# EAGLE design Adafruit CC3000 Breakout (EAGLE 7.2.0)
COMPANY: ADAFRUIT INDUSTRIES; DRAWN: KTOWN; REV: C
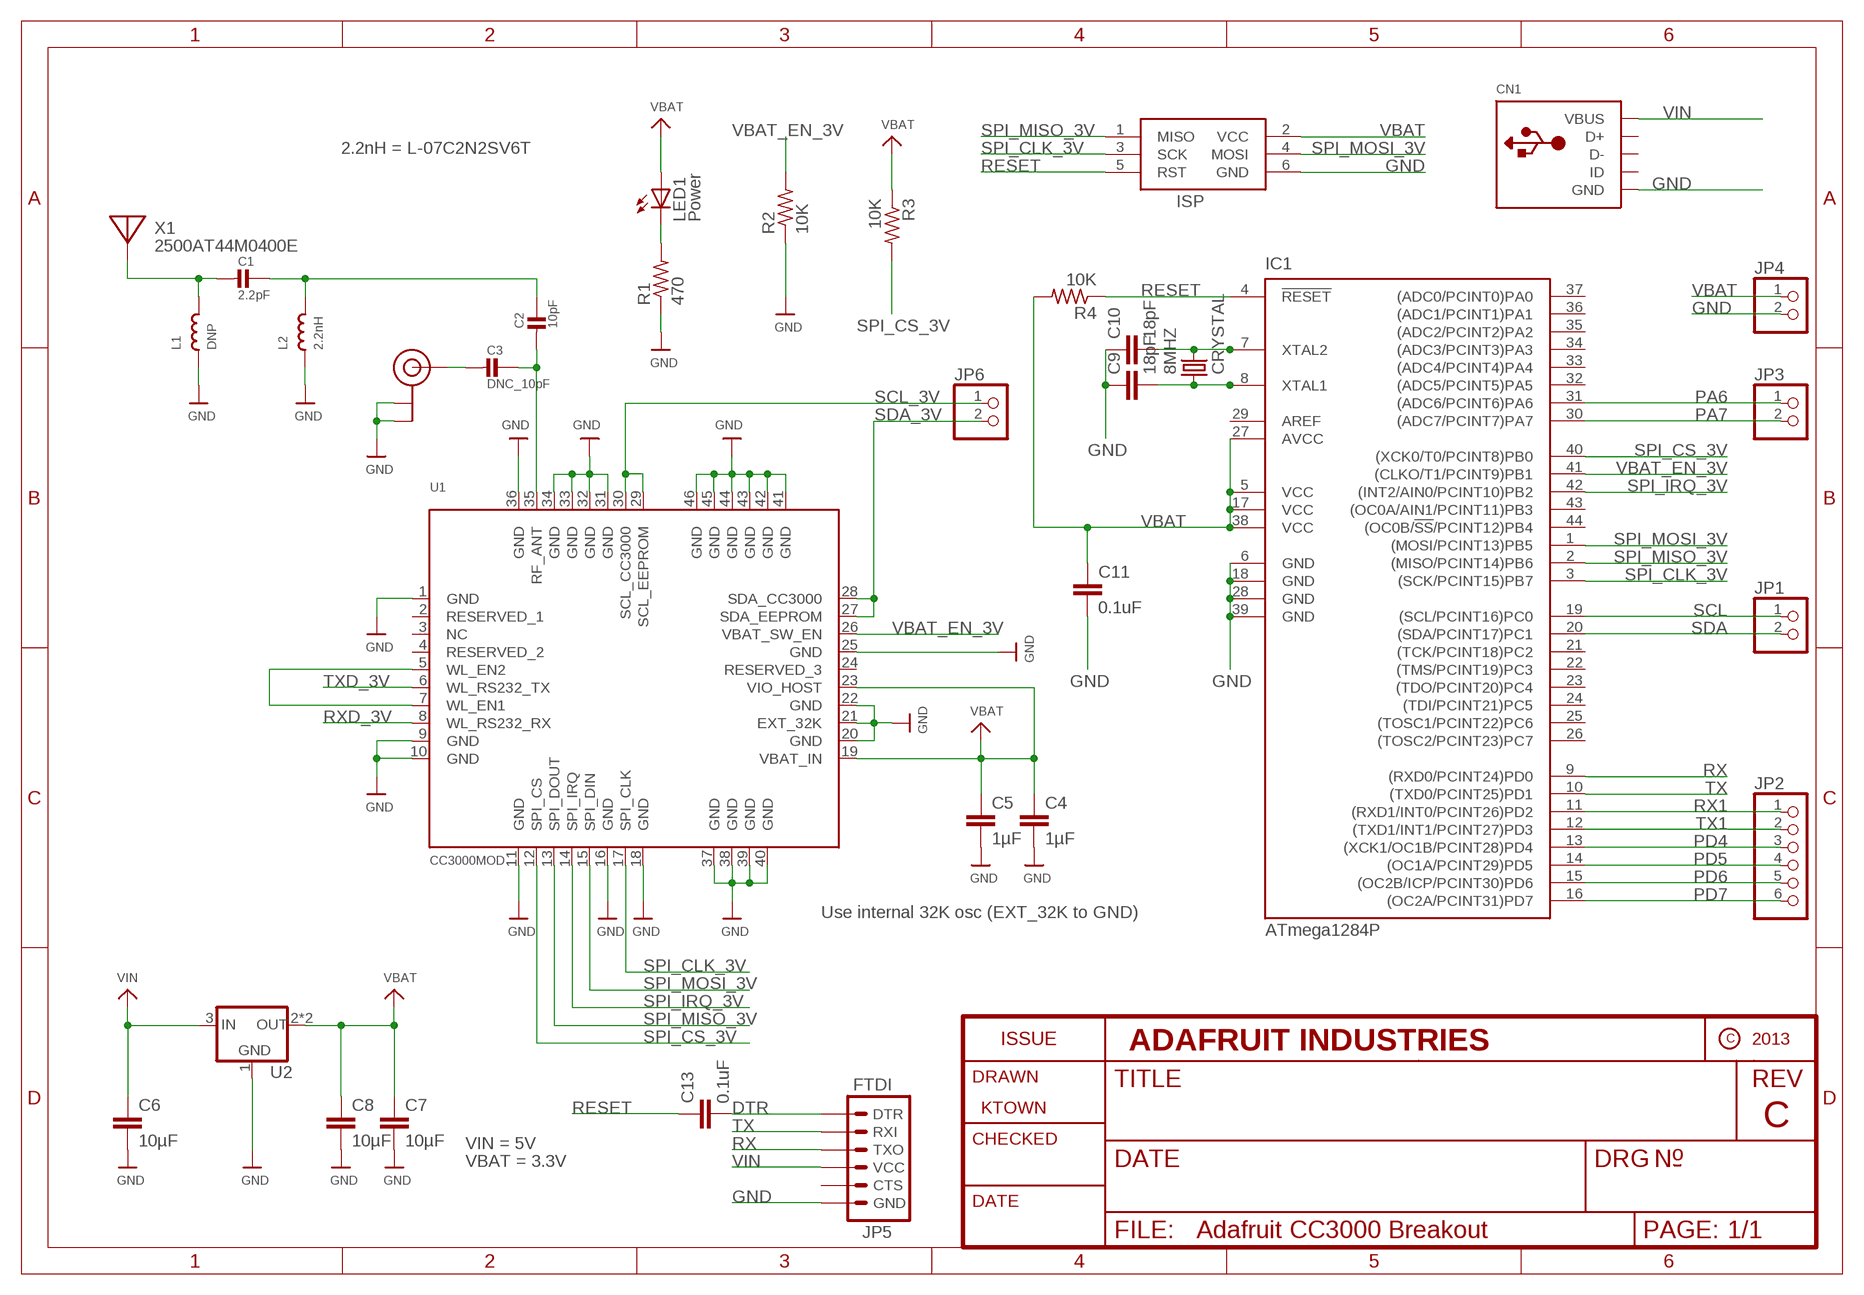
[diagram p0: schematic, sheet 1]

## Parts
8MHZ  CRYSTAL  [2-SMD-5X3MM]
C1  2.2pF  CAP_CERAMIC_0402  [_0402]
C2  10pF  CAP_CERAMIC_0402  [_0402]
C3  DNC_10pF  CAP_CERAMIC_0402  [_0402]
C4  1µF  C-EUC1206  [C1206]
C5  1µF  C-EUC1206  [C1206]
C6  10µF  C-EUC1206  [C1206]
C7  10µF  C-EUC1206  [C1206]
C8  10µF  C-EUC1206  [C1206]
C9  18pF  C-EUC1206  [C1206]
C10  18pF  C-EUC1206  [C1206]
C11  0.1uF  C-EUC1206  [C1206]
C13  0.1uF  C-EUC1206  [C1206]
CN1  USBPWR  [USB-MINIB-POWER]
IC1  ATmega1284P  MEGA164P/324P/644P-AU  [TQFP44]
ISP  AVRISP-6  [AVRISP]
JP1  PINHD-1X2  [1X02]
JP2  PINHD-1X6  [1X06]
JP3  PINHD-1X2  [1X02]
JP4  PINHD-1X2  [1X02]
JP5  FTDI  ARDUINO_SERIAL_PROGRAMPTH  [1X06]
JP6  PINHD-1X2  [1X02]
L1  DNP  INDUCTOR_0402  [_0402]
L2  2.2nH  INDUCTOR_0402  [_0402]
LED1  Power  LEDSMT1206  [1206]
R1  470  R-US_R1206  [R1206]
R2  10K  R-US_R1206  [R1206]
R3  10K  R-US_R1206  [R1206]
R4  10K  R-US_R1206  [R1206]
U1  CC3000MOD  [CC3000MOD]
U2  VREG_SOT223  [SOT223-R]
U$35  U.FL  [U.FL]
X1  2500AT44M0400E  ANTENNA_JOHANSON_2500AT44M0400  [ANT_2500AT44M0400]

## Nets
DTR: C13.2 JP5.DTR
GND: C4.2 C5.2 C6.2 C7.2 C8.2 C9.1 C10.1 C11.2 CN1.GND IC1.6(GND) IC1.18(GND) IC1.28(GND) IC1.39(GND) ISP.6(GND) JP4.2 JP5.GND L1.1 L2.1 R1.1 R2.1 U1.1(GND) U1.9(GND) U1.10(GND) U1.11(GND) U1.16(GND) U1.18(GND) U1.20(GND) U1.21(EXT_32K) U1.22(GND) U1.25(GND) U1.31(GND) U1.32(GND) U1.33(GND) U1.34(GND) U1.36(GND) U1.37(GND) U1.38(GND) U1.39(GND) U1.40(GND) U1.41(GND) U1.42(GND) U1.43(GND) U1.44(GND) U1.45(GND) U1.46(GND) U2.1(GND) U$35.P$1(GND) U$35.P$2(GND)
N$1: C1.2 L1.2 X1.FEED
N$2: C1.1 C2.1 L2.2
N$3: C3.2 U$35.P$3(SIGNAL)
N$4: C2.2 C3.1 U1.35(RF_ANT)
N$6: U1.5(WL_EN2) U1.7(WL_EN1)
N$7: LED1.C R1.2
N$8: 8MHZ.P$2 C10.2 IC1.7(XTAL2)
N$10: 8MHZ.P$1 C9.2 IC1.8(XTAL1)
PA6: IC1.31((ADC6/PCINT6)PA6) JP3.1
PA7: IC1.30((ADC7/PCINT7)PA7) JP3.2
PD4: IC1.13((XCK1/OC1B/PCINT28)PD4) JP2.3
PD5: IC1.14((OC1A/PCINT29)PD5) JP2.4
PD6: IC1.15((OC2B/ICP/PCINT30)PD6) JP2.5
PD7: IC1.16((OC2A/PCINT31)PD7) JP2.6
RESET: C13.1 IC1.4(!RESET) ISP.5(RST) R4.1
RX: IC1.9((RXD0/PCINT24)PD0) JP5.TXO
RX1: IC1.11((RXD1/INT0/PCINT26)PD2) JP2.1
RXD_3V: U1.8(WL_RS232_RX)
SCL: IC1.19((SCL/PCINT16)PC0) JP1.1
SCL_3V: JP6.1 U1.29(SCL_EEPROM) U1.30(SCL_CC3000)
SDA: IC1.20((SDA/PCINT17)PC1) JP1.2
SDA_3V: JP6.2 U1.27(SDA_EEPROM) U1.28(SDA_CC3000)
SPI_CLK_3V: IC1.3((SCK/PCINT15)PB7) ISP.3(SCK) U1.17(SPI_CLK)
SPI_CS_3V: IC1.40((XCK0/T0/PCINT8)PB0) R3.2 U1.12(SPI_CS)
SPI_IRQ_3V: IC1.42((INT2/AIN0/PCINT10)PB2) U1.14(SPI_IRQ)
SPI_MISO_3V: IC1.2((MISO/PCINT14)PB6) ISP.1(MISO) U1.13(SPI_DOUT)
SPI_MOSI_3V: IC1.1((MOSI/PCINT13)PB5) ISP.4(MOSI) U1.15(SPI_DIN)
TX: IC1.10((TXD0/PCINT25)PD1) JP5.RXI
TX1: IC1.12((TXD1/INT1/PCINT27)PD3) JP2.2
TXD_3V: U1.6(WL_RS232_TX)
VBAT [power]: C4.1 C5.1 C7.1 C8.1 C11.1 IC1.5(VCC) IC1.17(VCC) IC1.27(AVCC) IC1.38(VCC) ISP.2(VCC) JP4.1 LED1.A R3.1 R4.2 U1.19(VBAT_IN) U1.23(VIO_HOST) U2.2(OUT) U2.4(OUT)
VBAT_EN_3V: IC1.41((CLKO/T1/PCINT9)PB1) R2.2 U1.26(VBAT_SW_EN)
VIN [power]: C6.1 CN1.VBUS JP5.VCC U2.3(IN)
Unconnected: CN1.D+ CN1.D- CN1.ID IC1.21((TCK/PCINT18)PC2) IC1.22((TMS/PCINT19)PC3) IC1.23((TDO/PCINT20)PC4) IC1.24((TDI/PCINT21)PC5) IC1.25((TOSC1/PCINT22)PC6) IC1.26((TOSC2/PCINT23)PC7) IC1.32((ADC5/PCINT5)PA5) IC1.33((ADC4/PCINT4)PA4) IC1.34((ADC3/PCINT3)PA3) IC1.35((ADC2/PCINT2)PA2) IC1.36((ADC1/PCINT1)PA1) IC1.37((ADC0/PCINT0)PA0) IC1.43((OC0A/AIN1/PCINT11)PB3) IC1.44((OC0B/!SS!/PCINT12)PB4) JP5.CTS U1.2(RESERVED_1) U1.3(NC) U1.4(RESERVED_2) U1.24(RESERVED_3)

## Notes on the sheet
- 2.2nH = L-07C2N2SV6T
- Use internal 32K osc (EXT_32K to GND)
- VIN = 5V
- VBAT = 3.3V

## Power pins joined to a net without a drawn wire
AREF: IC1.29(AREF)

## Library data of the parts
8MHZ = Net Widget:CRYSTAL
C1-C3 = microbuilder:CAP_CERAMIC: Ceramic Capacitors For new designs, use the packages preceded by an '_' character since they are more reliable: The following footprints should be used on most boards: _0402 - Standard footprint for regular board layouts _0603 - Standard footprint for regular board layouts _0805 - Standard footprint for regular board layouts For extremely tight-pitch boards where space is at a premium, the following 'micro-pitch' footprints can be used (smaller pads, no silkscreen outline, etc.): _0402MP - Micro-pitch footprint for very dense/compact boards _0603MP - Micro-pitch footprint for very dense/compact boards _0805MP - Micro-pitch footprint for very dense/compact boards Commonly Stocked Parts 0402 - 0402 Surface Mount Capacitors 16pF 50V 5% [Digikey: 445-4899-2-ND] 18pF 50V 5% [Digikey: 490-1281-2-ND] 22pF 50V 5% [Digikey: 490-1283-2-ND] 68pF 50V 5% [Digikey: 490-1289-2-ND] 0.1uF 10V 10% [Digikey: 490-1318-2-ND] 1.0uF 6.3V 10% [Digikey: 490-1320-2-ND] 0603 - 0603 Surface Mount Capacitors 16 pF 50V 5% [Digikey: 445-5051-2-ND] 22 pF 50V [Digikey: PCC220ACVTR-ND] 33 pF 50V 5% [Digikey: 490-1415-1-ND] 56pF 50V 5% [Digikey: 490-1421-1-ND] 220pF 50V 5% [Digikey: 445-1285-1-ND] 680 pF 50V 2200 pF 50V 5% C0G [Digikey: 445-1297-1-ND] 5600 pF 100V 5% X7R [Digikey: 478-3711-1-ND] 0.1 µF 25V 10% [Digikey: PCC2277TR-ND] 0.22 µF 16V 10% X7R [Digikey: 445-1318-1-ND] 1.0 µF 25V 10% [Digikey: 445-5146-2-ND] 0603 - RF Specific 3pF 250V +/-0.1pF RF [Digikey: 712-1347-1-ND] 18 pF 250V 5% [Digikey: 478-3505-1-ND or 712-1322-1-ND] 56 pF 250V 5% C0G RF [Digikey: 490-4867-1-ND] 68 pF 250V RF [Digikey: 490-4868-1-ND] 0805 - 0805 Surface Mount Capacitors 220 pF 250V 2% RF Ceramic Capacitor [Digikey: 712-1398-1-ND] 1000 pF 50V 2% NP0 Ceramic Capacitor [Digikey: 478-3760-1-ND] 0.1 µF 25V 10% Ceramic Capacitor [Digikey: PCC1828TR-ND] 1.0 µF 16V 10% Ceramic Capacitor[Digikey: 490-1691-2-ND] 10.0 µF 10V 10% Ceramic Capacitor[Digikey: 709-1228-1-ND] 10.0 uF 16V 10% Ceramic Capacitor [Digikey: 478-5165-2-ND] 47 uF 6.3V 20% Ceramic Capacitor [Digikey: 587-1779-1-ND or 399-5506-1-ND] 1206 - 1206 Surface Mount Capacitors 47uF 10V 20% Ceramic Capacitor [Digikey: 490-5528-1-ND or 399-5508-1-ND or 445-6010-1-ND] 100uF 6.3V -20%, +80% Y5V Ceramic Capacitor (Digikey: 490-4512-1-ND, Mouser: 81-GRM31CF50J107ZE1L)
C4-C11 C13 = rcl:C-EU: CAPACITOR, European symbol
CN1 = Net Widget:USB: USB Connectors USBMINIB - Surface Mount Female Mini-B USB Connector 4UConnector: 06564 By microbuilder.eu Thru-hole RA Female Mini-B USB Connector 4UConnector: 18732 By ladyada.net
IC1 = avr-5:MEGA164P/324P/644P-AU
ISP = adafruit:AVRISP: AVR ISP HEADER Standard 6 pin header for AVR programming
JP1 JP3 JP4 JP6 = pinhead:PINHD-1X2: PIN HEADER
JP2 = pinhead:PINHD-1X6: PIN HEADER
JP5 = Net Widget:ARDUINO_SERIAL_PROGRAM: FTDI connector footprints
L1 L2 = microbuilder:INDUCTOR: Inductors 0603: 10nH Ceramic Inductor - microwire antenna/RF (Digikey: 712-1434-2-ND) 0805: 560nH Ceramic Inductor - RF (Digikey: 553-1047-1-ND) 270nH Ceramic Inductor - Q = 40@250MHz, +-5%, 1 Ohm DC Resistance (Digikey: 535-10506-2-ND) 1007 (2518 Metric) SMT: 10µH 10% 250mOhm 820mA 1007 Inductor (Digikey: 587-2189-1-ND) 22µH 10% 500mOhm 580mA 1007 Inductor (Digikey: 587-2190-1-ND) 47µH 10% 950mOhm 420mA 1007 Inductor (Digikey: 587-2191-1-ND) 47µH 5% 100mOhm 1A 1008 Inductor (Digikey: 732-1816-1-ND) 5.0x5.0mm (Taiyo Yuden NR5040 Series) 6.8µH 20% 2.3A 64mOhm Inductor (Digikey: 587-2374-2-ND) 5.0x5.0mm (TDK VLC5045 Series) 4.7µH 20% 3.3A 34mOhm Inductor (Digikey: 445-6526-1-ND) 6.8µH 20% 2.7A 46mOhm Inductor (Digikey: 445-6527-1-ND) 6.0x6.0mm (TDK VLC6045 Series) 4.7µH 20% 3.8A 27mOhm Inductor (Digikey: 445-6538-2-ND) 6.8µH 20% 3A 41mOhm Inductor (Digikey: 445-6540-1-ND) 6.2µH 30% 2.2A 45mOhm Inductor (Digikey: SRR5028-6R2YCT-ND) - Not TDK VLC6045 but footprint should match 6.0x6.0mm (TDK SLF6045 Series) 6.8uH 30% 2A 33mOhm Inductor (Digikey: 445-4572-1-ND, Mouser: 810-SLF645T6R8N2R0PF) 6.0x6.0mm (Sumida CDRH5D28 Series) 6.2uH 30% 1.8A 45mOhm Inductor (Digikey: 308-1542-1-ND) Taiyo Yuden NR3015T2R2M - 2.2uH 20% 1.5A (Digikey: 587-1648-2-ND, Mouser: 963-NR3015T2R2M) - Used with TI TPS62172 CoilCraft RFID Transponder Coil - MA5532-AE (For use with AS3935 Lightning Sensor)
LED1 = led:LED: LED OSRAM: - CHIPLED LG R971, LG N971, LY N971, LG Q971, LY Q971, LO R971, LY R971 LH N974, LH R974 LS Q976, LO Q976, LY Q976 LO Q996 - Hyper CHIPLED LW Q18S LB Q993, LB Q99A, LB R99A - SideLED LS A670, LO A670, LY A670, LG A670, LP A670 LB A673, LV A673, LT A673, LW A673 LH A674 LY A675 LS A676, LA A676, LO A676, LY A676, LW A676 LS A679, LY A679, LG A679 - Hyper Micro SIDELED® LS Y876, LA Y876, LO Y876, LY Y876 LT Y87S - SmartLED LW L88C, LW L88S LB L89C, LB L89S, LG L890 LS L89K, LO L89K, LY L89K LS L896, LA L896, LO L896, LY L896 - TOPLED LS T670, LO T670, LY T670, LG T670, LP T670 LSG T670, LSP T670, LSY T670, LOP T670, LYG T670 LG T671, LOG T671, LSG T671 LB T673, LV T673, LT T673, LW T673 LH T674 LS T676, LA T676, LO T676, LY T676, LB T676, LH T676, LSB T676, LW T676 LB T67C, LV T67C, LT T67C, LS T67K, LO T67K, LY T67K, LW E67C LS E67B, LA E67B, LO E67B, LY E67B, LB E67C, LV E67C, LT E67C LW T67C LS T679, LY T679, LG T679 LS T770, LO T770, LY T770, LG T770, LP T770 LB T773, LV T773, LT T773, LW T773 LH T774 LS E675, LA E675, LY E675, LS T675 LS T776, LA T776, LO T776, LY T776, LB T776 LHGB T686 LT T68C, LB T68C - Hyper Mini TOPLED® LB M676 - Mini TOPLED Santana® LG M470 LS M47K, LO M47K, LY M47K Source: http://www.osram.convergy.de LUXEON: - LUMILED® LXK2-PW12-R00, LXK2-PW12-S00, LXK2-PW14-U00, LXK2-PW14-V00 LXK2-PM12-R00, LXK2-PM12-S00, LXK2-PM14-U00 LXK2-PE12-Q00, LXK2-PE12-R00, LXK2-PE12-S00, LXK2-PE14-T00, LXK2-PE14-U00 LXK2-PB12-K00, LXK2-PB12-L00, LXK2-PB12-M00, LXK2-PB14-N00, LXK2-PB14-P00, LXK2-PB14-Q00 LXK2-PR12-L00, LXK2-PR12-M00, LXK2-PR14-Q00, LXK2-PR14-R00 LXK2-PD12-Q00, LXK2-PD12-R00, LXK2-PD12-S00 LXK2-PH12-R00, LXK2-PH12-S00 LXK2-PL12-P00, LXK2-PL12-Q00, LXK2-PL12-R00 Source: www.luxeon.com KINGBRIGHT: KA-3528ASYC Source: www.kingbright.com
R1-R4 = rcl:R-US_: RESISTOR, American symbol
U1 = microbuilder:CC3000MOD: CC3000MOD Wifi Module
U2 = microbuilder:VREG_SOT223: SOT-223 Fixed Voltage Regulators Part Current Out V Out V In V Dropout θJA (°C/W) TJ (°C) Operating Temp Digikey Part No. AP1117 1A 3.3V 18V 1.1V@500mA, 1.3V@1A 107°C/W 150°C -40°C-125°C AP1117IE33G-13DICT-ND Max operating temp can be calculated using θJA, TJ (max junction temperature), and power in watts. Set the "Maximum Ambient Temperature" until it reaches TJ ("Max Junction Temperature"), which is the absolute limit for safe use of the regulator: Heat Sink Temperature Calculator <http://www.daycounter.com/Calculators/Heat-Sink-Temperature-Calculator.phtml> For example, With 12V source into a 3.3V LP2985 and a 30mA load, we are dissipating (12V-3.3V) * 0.03A = 0.261W. With a θJA of 206 °C/W, a TJ of 150°C, and 261mW we can safely use the chip without a heat sink up to 75°C (=147.1°C Junction Temperature).
U$35 = microbuilder:U.FL: U.FL Antenna Connector
X1 = microbuilder:ANTENNA_JOHANSON_2500AT44M0400: Johanson 2.3-2.7 GHz Chip Antenna Frequency Range: 2400 - 2500 Mhz Peak Gain 2.5 dBi typ. (XZ-V) Average Gain 0.5 dBi typ. (XZ-V) Input Power 3W max. Operating Temperature -40 to +85°C Digikey: 712-1403-1-ND Mouser: 609-2500AT44M0400E

## Net classes
1 power: width 0.406 mm

## Board
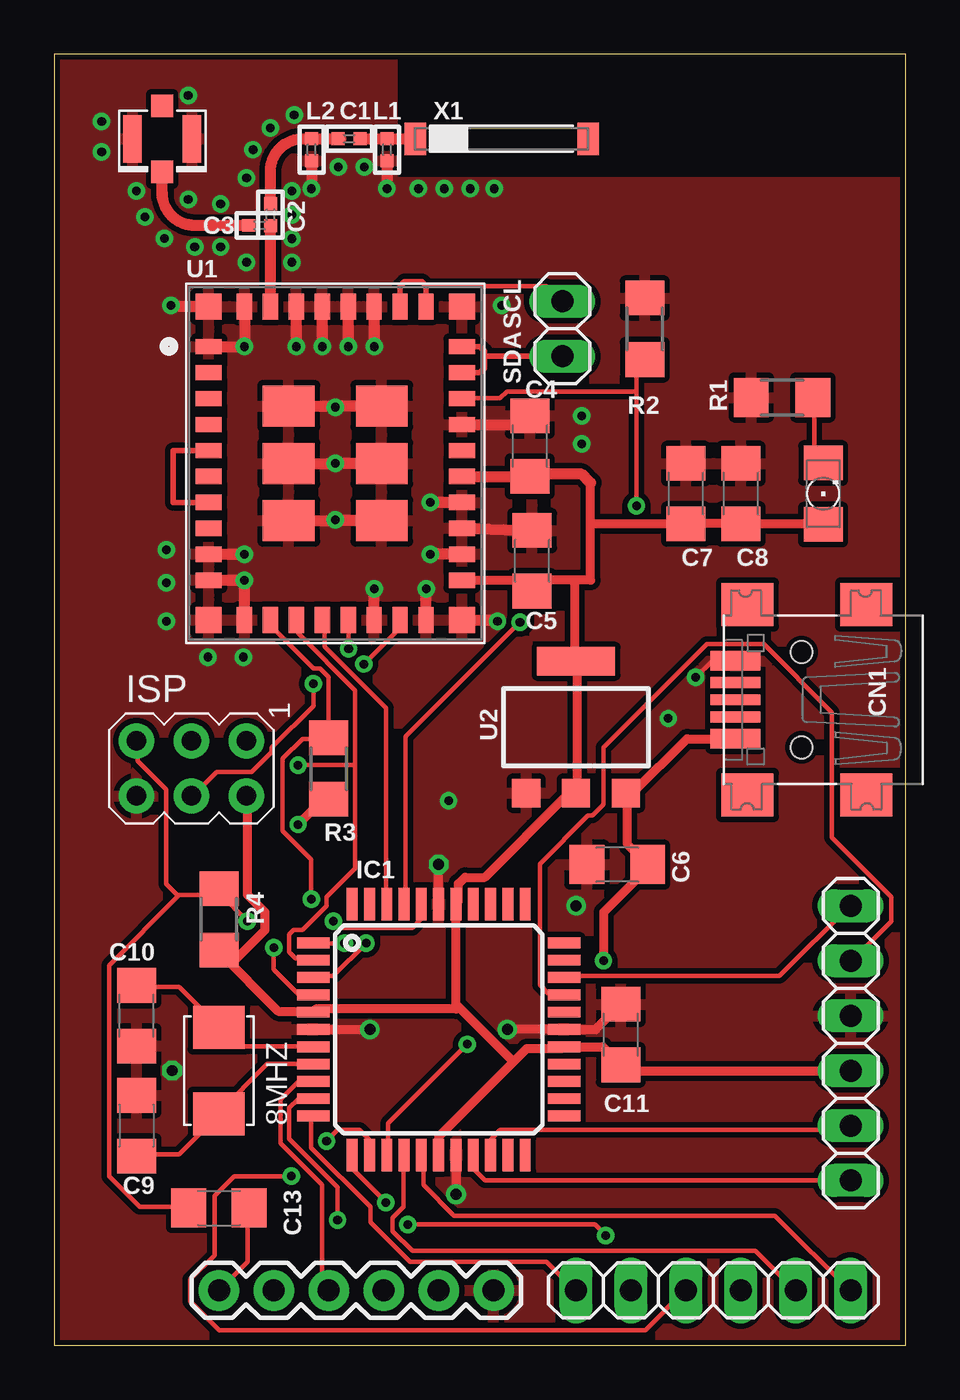
[diagram p1: board, top side]
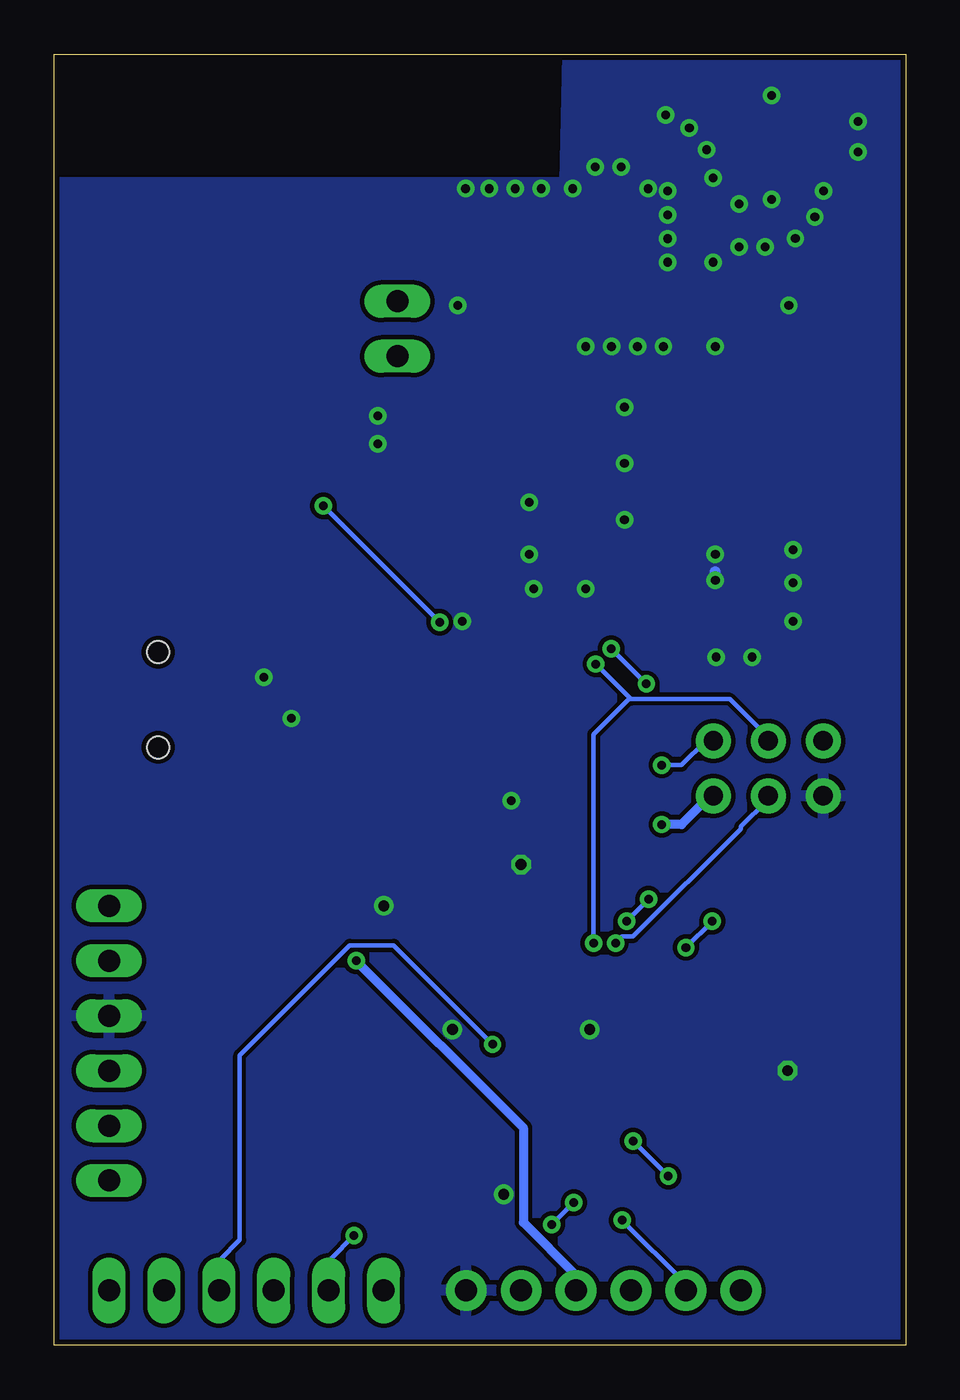
[diagram p2: board, bottom side, seen from below]

Size 39.37 x 59.69 mm. Coordinates in mm from the lower left corner, seen from the top.
Outline: 0,0 39.37,0 39.37,59.69 0,59.69 0,0
Copper layers (1*16): Top 0.035mm / dielectric 1.5mm / Bottom 0.035mm
Design rules "adafruit": minimum track width 8mil, minimum drill 15.5mil, track to track 8mil, track to pad 8mil, pad to pad 8mil, via to via 8mil, smd to smd 8mil, copper to edge 10mil, drill to drill 8mil, minimum pad ring 10mil, minimum via ring 8mil, stop-mask expansion 4mil, vias tented up to drill 20mil, thermal gap 10mil

### Footprints (pad centres in the part's own frame; a part is rotated, then mirrored left to right if it is on the bottom)
2-SMD-5X3MM = smd 2 x 2.4: P$1 -2,0; P$2 2,0
_0402 = smd 0.6 x 0.6: 1 -0.508,0; 2 0.508,0
C1206 = smd 1.6 x 1.8: 1 -1.4,0; 2 1.4,0
USB-MINIB-POWER = smd 0.5 x 2.308: D+ 0,5.334; D- -0.8,5.334; ID 0.8,5.334 | smd 0.9 x 2.308: GND 1.8,5.334; VBUS -1.8,5.334 | smd 2 x 2.4: GND1 -4.4,-0.73; GND2 -4.4,4.77; GND3 4.4,4.77; GND4 4.4,-0.73 | hole 1: -2.2,2.27; 2.2,2.27
TQFP44 = smd 1.5 x 0.5: 1 -5.8,4; 2 -5.8,3.2; 3 -5.8,2.4; 4 -5.8,1.6; 5 -5.8,0.8; 6 -5.8,0; 7 -5.8,-0.8; 8 -5.8,-1.6; 9 -5.8,-2.4; 10 -5.8,-3.2; 11 -5.8,-4; 23 5.8,-4; 24 5.8,-3.2; 25 5.8,-2.4; 26 5.8,-1.6; 27 5.8,-0.8; 28 5.8,0; 29 5.8,0.8; 30 5.8,1.6; 31 5.8,2.4; 32 5.8,3.2; 33 5.8,4 | smd 0.5 x 1.5: 12 -4,-5.8; 13 -3.2,-5.8; 14 -2.4,-5.8; 15 -1.6,-5.8; 16 -0.8,-5.8; 17 0,-5.8; 18 0.8,-5.8; 19 1.6,-5.8; 20 2.4,-5.8; 21 3.2,-5.8; 22 4,-5.8; 34 4,5.8; 35 3.2,5.8; 36 2.4,5.8; 37 1.6,5.8; 38 0.8,5.8; 39 0,5.8; 40 -0.8,5.8; 41 -1.6,5.8; 42 -2.4,5.8; 43 -3.2,5.8; 44 -4,5.8
AVRISP = drill 0.9 pad 1.626: 1 -1.27,2.54; 2 1.27,2.54; 3 -1.27,0; 4 1.27,0; 5 -1.27,-2.54; 6 1.27,-2.54
1X02 = drill 1.016 long: 1 -1.27,0; 2 1.27,0
1X06 = drill 1.016 long: 1 -6.35,0; 2 -3.81,0; 3 -1.27,0; 4 1.27,0; 5 3.81,0; 6 6.35,0
1X06' = drill 1.016 pad 1.88: CTS 10.16,0; DTR 0,0; GND 12.7,0; RXI 2.54,0; TXO 5.08,0; VCC 7.62,0
1206 = smd 1.6 x 1.803: A -1.422,0; C 1.422,0
R1206 = smd 1.6 x 1.803: 1 -1.422,0; 2 1.422,0
CC3000MOD = smd 1.2 x 0.7: 1 -5.85,5.4; 2 -5.85,4.2; 3 -5.85,3; 4 -5.85,1.8; 5 -5.85,0.6; 6 -5.85,-0.6; 7 -5.85,-1.8; 8 -5.85,-3; 9 -5.85,-4.2; 10 -5.85,-5.4; 19 5.85,-5.4; 20 5.85,-4.2; 21 5.85,-3; 22 5.85,-1.8; 23 5.85,-0.6; 24 5.85,0.6; 25 5.85,1.8; 26 5.85,3; 27 5.85,4.2; 28 5.85,5.4 | smd 0.7 x 1.2: 11 -4.2,-7.25; 12 -3,-7.25; 13 -1.8,-7.25; 14 -0.6,-7.25; 15 0.6,-7.25; 16 1.8,-7.25; 17 3,-7.25; 18 4.2,-7.25; 29 4.2,7.25; 30 3,7.25; 31 1.8,7.25; 32 0.6,7.25; 33 -0.6,7.25; 34 -1.8,7.25; 35 -3,7.25; 36 -4.2,7.25 | smd 2.4 x 1.9: 37 -2.15,2.65; 38 -2.15,0; 39 -2.15,-2.65; 40 2.15,2.65; 41 2.15,0; 42 2.15,-2.65 | smd 1.2 x 1.2: 43 -5.85,7.25; 44 -5.85,-7.25; 45 5.85,-7.25; 46 5.85,7.25
SOT223-R = smd 1.3 x 1.3: 1 -2.3,-3.05; 2 0,-3.05; 3 2.3,-3.05 | smd 3.6 x 1.3: 4 0,3.05
U.FL = smd 2.2 x 0.85: P$1 0,1.375; P$2 0,-1.375 | smd 1.05 x 1: P$3 1.525,0; P$4 -1.525,0
ANT_2500AT44M0400 = smd 1 x 1.5: FEED 4,0; NC -4,0

### Placement (x,y rotation side)
8MHZ  7.62,12.7 90 top
C1  13.65,55.77 0 top
C2  10,52.27 270 top
C3  9.5,51.77 180 top
C4  22,41.57 90 top
C5  22.1,36.27 90 top
C6  26.04,22.23 180 top
C7  29.21,39.37 90 top
C8  31.75,39.37 90 top
C9  3.81,10.16 270 top
C10  3.81,15.24 90 top
C11  26.2,14.37 90 top
C13  7.62,6.35 0 top
CN1  36.83,29.84 90 top
IC1  17.78,14.61 0 top
ISP  6.35,26.67 270 top
JP1  36.83,8.89 90 top
JP2  30.48,2.54 0 top
JP3  36.83,19.05 270 top
JP4  36.83,13.97 90 top
JP5  FTDI  [1X06']  7.62,2.54 0 top
JP6  23.5,46.99 270 top
L1  15.39,55.27 90 top
L2  11.9,55.27 90 top
LED1  35.56,39.37 90 top
R1  33.66,43.81 0 top
R2  27.3,46.99 270 top
R3  12.7,26.67 90 top
R4  7.62,19.68 270 top
U1  13,40.77 0 top
U2  24.13,28.57 0 top
U$35  5,55.77 270 top
X1  20.69,55.77 180 top

### Tracks (layer width: path | path; a pad name or v marks a point on that pad's centre or on a via)
DTR
  Top 0.203: JP5.DTR 8.94,3.86 8.94,6.3 C13.2
GND  (via drill 0.39, 0.4, 0.5)
  Top 0.203: 3.76,11.79 C9.1 | v29.67,30.89 30.38,31.6 31.5,31.6 CN1.GND
  Top 0.406: IC1.39 v17.78,22.23 | C11.2 25.04,14.61 IC1.28 v20.95,14.61 | IC1.18 v18.58,6.99 | IC1.6 v14.61,14.61
  Top 0.5: U1.10 v8.8,35.37 U1.11 | U1.9 v8.8,36.57 | U1.37 12.95,43.42 v13,43.37 13.05,43.42 U1.40 | U1.38 v13,40.77 U1.41 | U1.39 12.95,38.12 v13,38.17 13.05,38.12 U1.42 | U1.21 C5.2 | U1.25 21.72,42.57 C4.2 | U1.22 v17.4,38.97 | U1.20 v17.4,36.57 | U1.16 v14.8,34.97 | U1.18 v17.2,34.97 | U1.45 20.45,33.52 v20.5,33.47 | U1.1 v8.8,46.17 U1.36 | U1.34 v11.2,46.17 | U1.33 v12.4,46.17 | U1.32 v13.6,46.17 | U1.31 v14.8,46.17 | U1.43 5.45,48.02 v5.4,48.07 | L2.1 v11.9,53.47 | L1.1 v15.39,53.47
  Bottom 0.5: v8.8,35.37 8.8,35.77
  other vias: 5.2,33.47 11,50.07 8.9,50.07 7.7,52.77 6.2,52.97 7.7,50.77 6.5,50.77 5.1,51.17 8.9,53.97 9.2,55.27 10,56.27 11.1,56.87 13.15,54.47 14.35,54.47 2.2,56.57 2.2,55.17 6.2,57.77 4.2,52.17 3.8,53.37 20.7,48.07 24.4,42.97 24.4,41.67 16.85,53.47 18.05,53.47 19.25,53.47 20.35,53.47 11,53.36 11,52.26 11,51.16 5.2,35.25 5.2,36.77 7.11,31.82 8.76,31.82 5.46,12.7 24.13,20.32 28.4,28.98 18.24,25.17
  pour Bottom: 0,0 39.37,0 39.37,53.77 15.75,53.77 15.62,59.69 0,59.69
  pour Top (isolate 0.254): 15.62,59.69 15.62,53.77 39.37,53.77 39.37,0 0,0 0,59.69
N$1
  Top 0.508: C1.2 15.48,55.77 | L1.2 X1.FEED
  Top 0.584: 15.48,55.77 arc90 L1.2
N$2
  Top 0.508: C2.1 10,54.27 arc-90 11.5,55.77 11.99,55.77 | L2.2 13.23,55.78
  Top 0.584: 11.99,55.77 arc90 L2.2 | 13.23,55.78 arc-90 C1.1
N$3
  Top 0.508: C3.2 6.5,51.77 arc-90 5,53.27 U$35.P$3
N$4
  Top 0.508: U1.35 C2.2 C3.1
N$6
  Top 0.254: U1.5 5.5,41.37 5.5,38.97 U1.7
N$7
  Top 0.203: R1.2 35.15,43.79 35.15,41.25 35.56,40.84 LED1.C
N$8
  Top 0.203: 11.99,13.87 IC1.7 11.89,13.82 8.43,13.82 7.62,14.63 8MHZ.P$2 7.62,14.73 5.79,16.56 3.86,16.56 C10.2
N$10
  Top 0.203: 11.99,13.06 IC1.8 11.89,13.01 9.86,13.01 7.62,10.77 8MHZ.P$1 7.62,10.67 5.79,8.84 3.86,8.84 C9.2
PA6
  Top 0.203: IC1.31 23.67,17.07 33.53,17.07 36.78,20.32 JP3.1
PA7
  Top 0.203: IC1.30 23.57,16.26 22.86,16.26 22.45,16.66 22.45,22.25 24.69,24.49 24.89,24.49 25.4,24.99 25.4,27.64 30.18,32.41 32.82,32.41 35.97,29.26 35.97,23.47 38.71,20.73 38.71,19.61 36.88,17.78 JP3.2
PD4  (via drill 0.39)
  Top 0.203: v12.6,9.45 13.11,9.96 14.12,9.96 14.53,9.55 14.53,8.84 IC1.13 | v10.97,7.82 8.33,7.82 7.42,6.91 7.42,4.17 6.3,3.05 6.3,2.03 7.62,0.71 27.33,0.71 29.16,2.54 JP2.3
  Bottom 0.203: v10.97,7.82 v12.6,9.45
PD5  (via drill 0.39)
  Top 0.203: v19.1,13.92 15.44,10.26 15.44,8.84 IC1.14
  Bottom 0.203: v19.1,13.92 23.67,18.49 25.7,18.49 30.79,13.41 30.79,4.88 31.7,3.96 31.7,2.54 JP2.4
PD6
  Top 0.203: IC1.15 16.15,8.74 16.15,6.4 15.65,5.89 15.65,5.28 16.56,4.37 32.41,4.37 34.24,2.54 JP2.5
PD7
  Top 0.203: IC1.16 17.07,8.74 17.07,7.42 18.49,5.99 33.33,5.99 36.78,2.54 JP2.6
RESET  (via drill 0.39)
  Top 0.203: v10.16,18.39 10.16,17.37 11.28,16.26 11.89,16.26 IC1.4 | v8.94,19.61 7.62,20.93 R4.1 7.62,20.83 5.79,20.83 5.74,20.78 | 5.74,20.78 2.54,17.58 2.54,7.82 3.96,6.4 6.2,6.4 C13.1 | 5.74,20.78 5.18,21.34 5.18,25.7 3.86,27.03 3.86,27.94 ISP.5
  Bottom 0.203: v8.94,19.61 v10.16,18.39
RX
  Top 0.203: JP5.TXO 12.39,2.85 12.39,7.42 10.46,9.35 10.46,11.38 11.28,12.19 11.89,12.19 IC1.9
RX1
  Top 0.203: IC1.11 11.89,10.57 11.89,9.14 14.63,6.4 14.63,5.69 16.46,3.86 22.76,3.86 24.08,2.54 JP2.1
SCL
  Top 0.203: JP1.1 19.91,7.62 19.41,8.13 19.41,8.74 IC1.19
SCL_3V
  Top 0.203: 17.2,48.97 17.27,48.97 22.76,48.97 23.47,48.26 JP6.1
  Top 0.25: U1.29 17.2,48.97 17,49.17 16.2,49.17 16,48.97 U1.30
SDA
  Top 0.203: IC1.20 20.22,8.84 20.22,9.55 20.62,9.96 36.58,9.96 36.78,10.16 JP1.2
SDA_3V
  Top 0.25: U1.28 19.7,46.17 19.9,45.97 19.9,45.72 19.9,45.17 19.7,44.97 U1.27
  Top 0.254: JP6.2 19.9,45.72
SPI_CLK_3V  (via drill 0.39)
  Top 0.203: v14.33,31.5 15.95,33.12 15.95,33.43 U1.17 | v14.43,18.59 12.9,17.07 11.99,17.07 IC1.3
  Bottom 0.203: 12.75,29.92 12.7,29.87 8.13,29.87 6.4,28.14 6.4,27.94 ISP.3 | 12.75,29.92 v14.33,31.5 | v14.43,18.59 14.43,28.25 12.75,29.92
SPI_CS_3V  (via drill 0.39)
  Top 0.203: U1.12 10.06,33.43 10.06,33.22 11.99,31.29 12.29,31.29 12.7,30.89 R3.2 12.7,28.04 11.48,28.04 10.57,27.13 10.57,23.77 11.89,22.45 v11.89,20.62 | v12.9,19.61 13.21,19.3 16.56,19.3 16.97,19.71 16.97,20.32 IC1.40
  Bottom 0.203: v11.89,20.62 v12.9,19.61
SPI_IRQ_3V
  Top 0.203: U1.14 12.5,33.43 12.5,32.31 15.34,29.46 15.34,20.42 IC1.42
SPI_MISO_3V  (via drill 0.39)
  Top 0.203: 13.92,26.82 13.92,22.05 12.6,20.73 12.6,20.32 11.48,19.2 11.07,19.2 10.87,19 10.87,18.19 11.18,17.88 11.89,17.88 IC1.2 | 13.92,26.82 13.92,30.28 11.28,32.92 11.28,33.43 U1.13 | 13.92,26.82 v11.28,26.82
  Bottom 0.203: ISP.1 9.25,27.94 10.36,26.82 v11.28,26.82
SPI_MOSI_3V  (via drill 0.39)
  Top 0.203: v13.61,32.21 13.61,33.43 U1.15 | v11.99,30.58 11.99,29.57 10.06,27.64 10.06,27.43 9.14,26.52 7.52,26.52 6.4,25.4 ISP.4 | v13.41,18.59 11.99,18.59 IC1.1
  Bottom 0.203: v11.99,30.58 v13.61,32.21 | v13.41,18.59 13.11,18.9 12.6,18.9 7.62,23.88 7.62,23.98 6.4,25.2 6.4,25.4 ISP.4
TX  (via drill 0.39)
  Top 0.203: v13.11,5.79 13.11,7.32 10.87,9.55 10.87,10.97 11.28,11.38 11.89,11.38 IC1.10
  Bottom 0.203: v13.11,5.79 10.16,2.85 JP5.RXI
TX1  (via drill 0.39)
  Top 0.203: v15.34,6.6 13.82,8.13 13.82,8.74 IC1.12 | v16.36,5.59 24.99,5.59 v25.5,5.08
  Bottom 0.203: v16.36,5.59 v15.34,6.6 | v25.5,5.08 26.62,3.96 26.62,2.54 JP2.2
VBAT  (via drill 0.39)
  Top 0.406: U1.19 22.6,35.37 | 24.8,38 24.8,35.37 24.08,35.37 | 24.8,38 24.8,39.87 | 21.95,34.7 C5.1 22.6,35.37 | 24.08,35.37 22.6,35.37 | LED1.A 35.56,38 31.9,38 C8.1 31.7,38 29.26,38 C7.1 29.06,38 24.8,38 | 24.08,35.37 24.08,31.8 U2.4 24.18,31.6 24.18,25.6 U2.2 23.98,25.4 23.67,25.4 19.91,21.64 19,21.64 18.69,21.34 18.69,20.52 IC1.38 18.59,20.32 18.59,15.75 18.69,15.65 | v11.28,24.08 12.39,25.2 12.7,25.2 R3.1 | IC1.17 17.78,9.65 21.23,13.11 | 21.23,13.11 21.84,13.72 23.47,13.72 IC1.27 25.36,13.8 C11.1 26.31,12.8 26.42,12.7 JP4.1 | 21.23,13.11 18.69,15.65 | 18.69,15.65 18.59,15.54 12.09,15.54 IC1.5 11.89,15.44 10.36,15.44 7.62,18.19 R4.2 8.23,17.68 9.75,19.2 9.75,20.02 8.94,20.83 8.94,25.4 ISP.2
  Top 0.5: 24.8,39.87 24.4,40.27 22.02,40.27 C4.1 U1.23
  Bottom 0.406: v11.28,24.08 10.36,24.08 9.04,25.4 ISP.2
VBAT_EN_3V  (via drill 0.39)
  Top 0.203: v21.54,33.43 16.26,28.14 16.26,20.42 IC1.41 | 26.92,44.09 26.92,45.21 27.23,45.52 R2.2 | 26.92,44.09 v26.92,38.81 | 26.92,44.09 20.93,44.09 20.62,43.79 18.9,43.79 U1.26
  Bottom 0.203: v26.92,38.81 v21.54,33.43
VIN  (via drill 0.39)
  Top 0.406: CN1.VBUS 29.26,28.04 26.72,25.5 U2.3 26.52,25.5 26.52,23.16 27.43,22.25 C6.1 27.43,22.05 25.4,20.02 v25.4,17.78
  Bottom 0.406: JP5.VCC 15.24,3.25 17.68,5.69 17.68,10.06 v25.4,17.78

### Text on the board
tNames: SCL | SDA
tValues: Mellis (1/23/2015) | PA6 | PA7 | GND | VCC | SDA | SCL | RX1 | TX1 | PD4 | PD5 | PD6 | PD7 | G | B